# Altium project Digital_Module.PrjPcb (part 2 of 2)
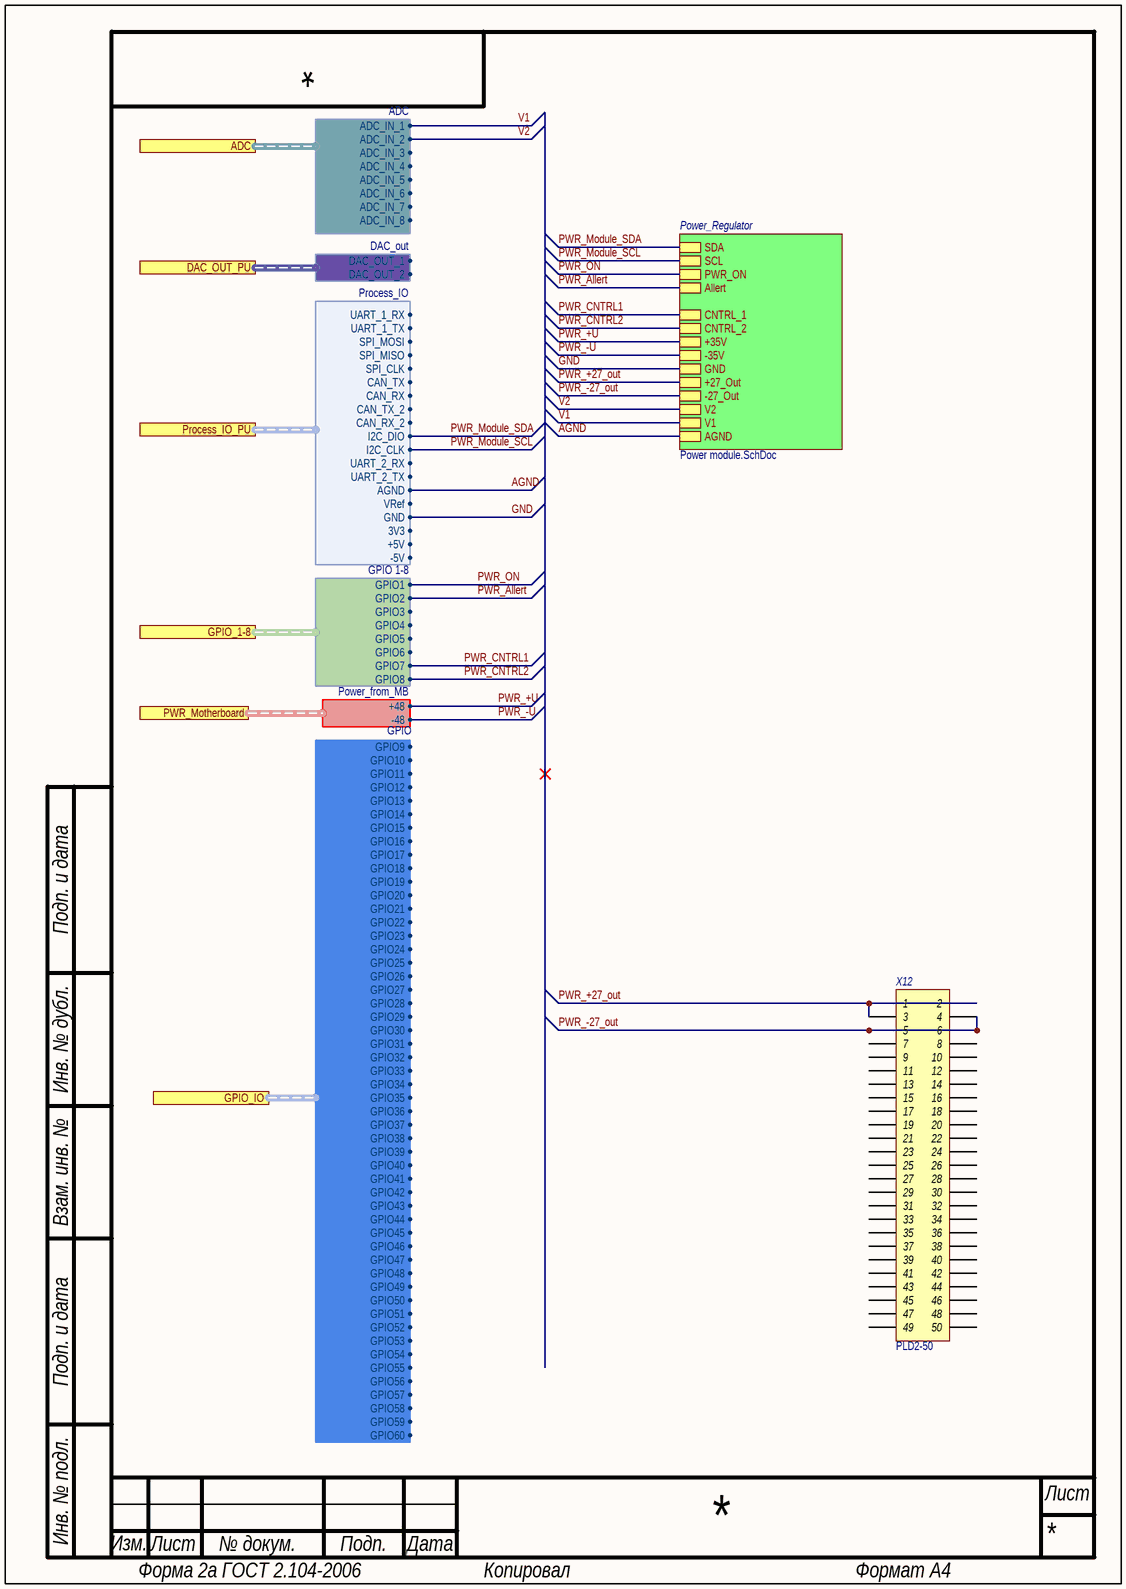
[diagram p8: Functional_Module_main.SchDoc]

## Nets that join several sheets
2V048: Module_main (X7.9), main (U4.32), power (C20.2 U2.3 U2.4)
3.3V: Module_main (X8.4 X9.3 X9.4), main (40 pins), power (12 pins)
3V3A: main (U4.33), power (C21.2 L1.2 U2.1 U2.2)
+5V: Module_main (X9.7 X9.8), power (R9.2 U1.8 U1.9)
-5V: Module_main (X9.9 X9.10), power (C14.1 C15.2 G1.5)
A_GND: Module_main (X7.10 X8.19 X8.20), main (U4.31), adc (8 pins), dac (C45.1 C46.1), power (C20.1 C21.1 L2.2 U2.5)
GND: Module_main (10 pins), main (36 pins), USB (C40.2 C41.1 U5.9 U5.15), power (21 pins)
GND_IN: Module_main (8 pins), main (L3.1 X3.11 X3.12), power (C10.2 C11.1 G1.2)
USB_GND_IN: main (L3.2 X3.7 X3.8), USB (7 pins)
ADC_IN_1: Module_main (X7.1), adc (R1.2)
ADC_IN_2: Module_main (X7.2), adc (R2.2)
ADC_IN_3: Module_main (X7.3), adc (R3.2)
ADC_IN_4: Module_main (X7.4), adc (R4.2)
ADC_IN_5: Module_main (X7.5), adc (R5.2)
ADC_IN_6: Module_main (X7.6), adc (R6.2)
ADC_IN_7: Module_main (X7.7), adc (R7.2)
ADC_IN_8: Module_main (X7.8), adc (R8.2)
ADC_MC_IN_1: main (U4.34), adc (C1.2 R1.1)
ADC_MC_IN_2: main (U4.35), adc (C2.2 R2.1)
ADC_MC_IN_3: main (U4.36), adc (C3.2 R3.1)
ADC_MC_IN_4: main (U4.37), adc (C4.2 R4.1)
ADC_MC_IN_5: main (U4.18), adc (C5.2 R5.1)
ADC_MC_IN_6: main (U4.19), adc (C6.2 R6.1)
ADC_MC_IN_7: main (U4.20), adc (C7.2 R7.1)
ADC_MC_IN_8: main (U4.21), adc (C8.2 R8.1)
CAN_RX: Module_main (X8.11), main (R28.2)
CAN_TX: Module_main (X8.12), main (R29.2)
D_IN_3_N: main (U4.103), USB (L6.2)
D_IN_3_P: main (U4.104), USB (L6.3)
DAC_MC_Out_1: main (U4.40), dac (R49.1)
DAC_MC_Out_2: main (U4.41), dac (R50.1)
DAC_OUT_1: Module_main (X8.17), dac (C45.2 R49.2)
DAC_OUT_2: Module_main (X8.18), dac (C46.2 R50.2)
GPIO_1: Module_main (X9.11), GPIO_Shunt (R51.2)
GPIO_2: Module_main (X9.12), GPIO_Shunt (R52.2)
GPIO_3: Module_main (X9.13), GPIO_Shunt (R53.2)
GPIO_4: Module_main (X9.14), GPIO_Shunt (R54.2)
GPIO_5: Module_main (X9.15), GPIO_Shunt (R55.2)
GPIO_6: Module_main (X9.16), GPIO_Shunt (R56.2)
GPIO_7: Module_main (X9.17), GPIO_Shunt (R57.2)
GPIO_8: Module_main (X9.18), GPIO_Shunt (R58.2)
GPIO_CPU_1: main (U4.26), GPIO_Shunt (R51.1)
GPIO_CPU_2: main (U4.27), GPIO_Shunt (R52.1)
GPIO_CPU_3: main (U4.28), GPIO_Shunt (R53.1)
GPIO_CPU_4: main (U4.29), GPIO_Shunt (R54.1)
GPIO_CPU_5: main (U4.44), GPIO_Shunt (R55.1)
GPIO_CPU_6: main (U4.45), GPIO_Shunt (R56.1)
GPIO_CPU_7: main (U4.96), GPIO_Shunt (R57.1)
GPIO_CPU_8: main (U4.97), GPIO_Shunt (R58.1)
I2C_CLK: Module_main (X8.14), main (U4.11)
I2C_DIO: Module_main (X8.13), main (U4.10)
I2C_SCL: main (R35.1 U4.136), power (U1.5 U3.5)
I2C_SDA: main (R34.1 U4.137), power (U1.4 U3.4)
Out_D_1_MB_N: main (X3.3 X3.4), USB (R45.1 X5.2)
Out_D_1_MB_P: main (X3.1 X3.2), USB (R46.1 X6.2)
Power_IN: Module_main (X10.1 X10.2 X10.3 X10.4), main (X3.9 X3.10), power (C9.1 C11.2 G1.1)
PWR_ALERT: main (U4.7), power (R14.2 U1.3 U3.3)
SPI_CLK: Module_main (X8.8), main (R24.2)
SPI_MISO: Module_main (X8.9), main (R25.2)
SPI_MOSI: Module_main (X8.7), main (R26.2)
UART_1_RX: Module_main (X8.3), main (R23.1)
UART_1_TX: Module_main (X8.5), main (R21.1)
UART_2_RX: Module_main (X8.15), main (R32.2)
UART_2_TX: Module_main (X8.16), main (R31.2)
V_in: main (X3.5 X3.6), USB (C42.2 C44.1 U5.1 X4.1)